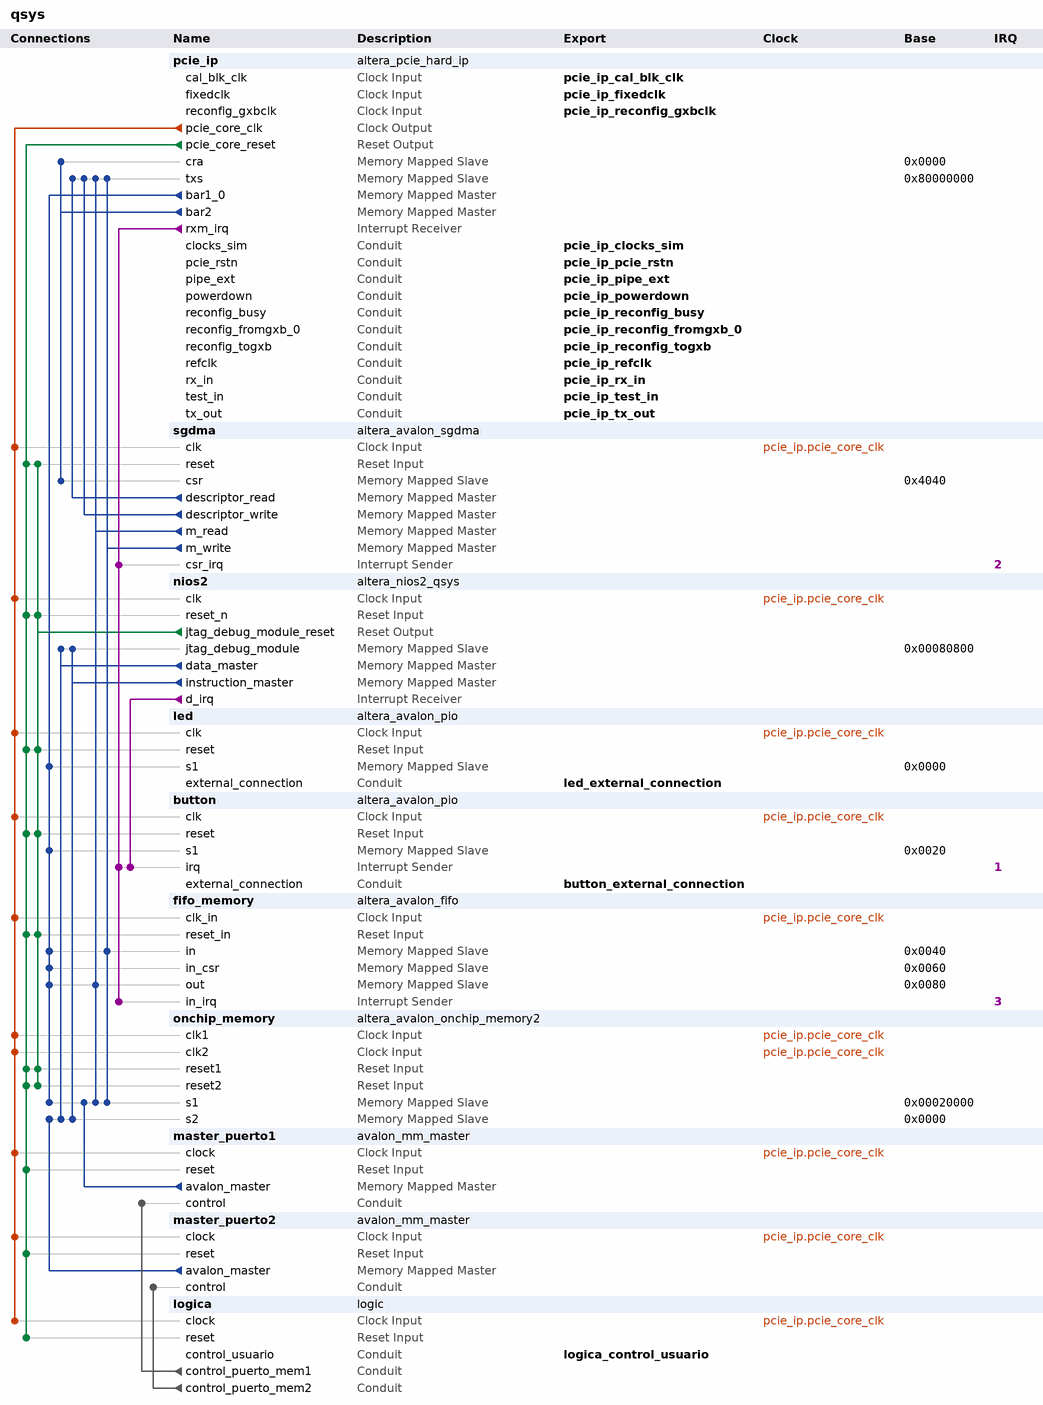
[diagram p0: system contents]
# Platform Designer (Qsys) system qsys, Cyclone IV GX EP4CGX150DF31C7
# Parameters at their usual value, and those the tool derives, are not listed.
package require -exact qsys 15.1
create_system qsys
set_project_property DEVICE_FAMILY {Cyclone IV GX}
set_project_property DEVICE EP4CGX150DF31C7

add_instance pcie_ip altera_pcie_hard_ip 15.1
set_instance_parameter_value pcie_ip {BAR Type} {64 bit Prefetchable,Not used,32 bit Non-Prefetchable,Not used,Not used,Not used}
set_instance_parameter_value pcie_ip CB_A2P_ADDR_MAP_PASS_THRU_BITS 31
set_instance_parameter_value pcie_ip CG_ENABLE_A2P_INTERRUPT 0
set_instance_parameter_value pcie_ip CG_NO_CPL_REORDERING 0
set_instance_parameter_value pcie_ip {PCIe Address 31:0} 0x00000000,0x00000000,0x00000000,0x00000000,0x00000000,0x00000000,0x00000000,0x00000000,0x00000000,0x00000000,0x00000000,0x00000000,0x00000000,0x00000000,0x00000000,0x00000000
set_instance_parameter_value pcie_ip {PCIe Address 63:32} 0x00000000,0x00000000,0x00000000,0x00000000,0x00000000,0x00000000,0x00000000,0x00000000,0x00000000,0x00000000,0x00000000,0x00000000,0x00000000,0x00000000,0x00000000,0x00000000
set_instance_parameter_value pcie_ip class_code 0
set_instance_parameter_value pcie_ip device_id 57345
set_instance_parameter_value pcie_ip my_advanced_errors false
set_instance_parameter_value pcie_ip my_enable_ecrc_check false
set_instance_parameter_value pcie_ip my_enable_ecrc_gen false
set_instance_parameter_value pcie_ip p_pcie_test_out_width None
set_instance_parameter_value pcie_ip p_user_msi_enable 0
set_instance_parameter_value pcie_ip subsystem_device_id 4
set_instance_parameter_value pcie_ip subsystem_vendor_id 4466
set_instance_parameter_value pcie_ip vendor_id 4466

add_instance sgdma altera_avalon_sgdma 15.1
set_instance_parameter_value sgdma enableBurstTransfers false
set_instance_parameter_value sgdma enableUnalignedTransfers false
set_instance_parameter_value sgdma readBlockDataWidth 64
set_instance_parameter_value sgdma sinkErrorWidth 0
set_instance_parameter_value sgdma sourceErrorWidth 0
set_instance_parameter_value sgdma transferMode MEMORY_TO_MEMORY
set_instance_parameter_value sgdma writeBurstcountWidth 4

add_instance nios2 altera_nios2_qsys 15.1
set_instance_parameter_value nios2 breakSlave nios2.jtag_debug_module
set_instance_parameter_value nios2 exceptionSlave onchip_memory.s2
set_instance_parameter_value nios2 icache_size 4096
set_instance_parameter_value nios2 impl Tiny
set_instance_parameter_value nios2 muldiv_multiplierType DSPBlock
set_instance_parameter_value nios2 resetSlave onchip_memory.s2
set_instance_parameter_value nios2 resetrequest_enabled true

add_instance led altera_avalon_pio 15.1
set_instance_parameter_value led direction Output
set_instance_parameter_value led width 4

add_instance button altera_avalon_pio 15.1
set_instance_parameter_value button captureEdge true
set_instance_parameter_value button direction Input
set_instance_parameter_value button edgeType FALLING
set_instance_parameter_value button generateIRQ true
set_instance_parameter_value button irqType EDGE
set_instance_parameter_value button width 4

add_instance fifo_memory altera_avalon_fifo 15.1
set_instance_parameter_value fifo_memory avalonMMAvalonMMDataWidth 64
set_instance_parameter_value fifo_memory bitsPerSymbol 16
set_instance_parameter_value fifo_memory channelWidth 8
set_instance_parameter_value fifo_memory errorWidth 8
set_instance_parameter_value fifo_memory fifoDepth 2048
set_instance_parameter_value fifo_memory fifoInputInterfaceOptions AVALONMM_WRITE
set_instance_parameter_value fifo_memory fifoOutputInterfaceOptions AVALONMM_READ
set_instance_parameter_value fifo_memory singleClockMode true
set_instance_parameter_value fifo_memory symbolsPerBeat 2
set_instance_parameter_value fifo_memory useIRQ true
set_instance_parameter_value fifo_memory usePacket true
set_instance_parameter_value fifo_memory useReadControl false

add_instance onchip_memory altera_avalon_onchip_memory2 15.1
set_instance_parameter_value onchip_memory dataWidth 64
set_instance_parameter_value onchip_memory dualPort true
set_instance_parameter_value onchip_memory initMemContent true
set_instance_parameter_value onchip_memory initializationFileName {C:/Users/Mauricio Paz/Downloads/CodigoVerilog/quartus/filtros/datos_memoria.mif}
set_instance_parameter_value onchip_memory memorySize 131072
set_instance_parameter_value onchip_memory useNonDefaultInitFile true

add_instance master_puerto1 avalon_mm_master 1.0
set_instance_parameter_value master_puerto1 ADDRESS_BITS 18
set_instance_parameter_value master_puerto1 DATA_BITS 64

add_instance master_puerto2 avalon_mm_master 1.0
set_instance_parameter_value master_puerto2 ADDRESS_BITS 17
set_instance_parameter_value master_puerto2 DATA_BITS 64

add_instance logica logic 1.0
set_instance_parameter_value logica BITS_DATOS 8
set_instance_parameter_value logica BITS_DIRECCION_P1 18
set_instance_parameter_value logica BITS_DIRECCION_P2 17
set_instance_parameter_value logica BITS_PALABRA 64

# connections
add_connection pcie_ip.pcie_core_clk button.clk clock
add_connection pcie_ip.pcie_core_clk fifo_memory.clk_in clock
add_connection pcie_ip.pcie_core_clk led.clk clock
add_connection pcie_ip.pcie_core_clk logica.clock clock
add_connection pcie_ip.pcie_core_clk master_puerto1.clock clock
add_connection pcie_ip.pcie_core_clk master_puerto2.clock clock
add_connection pcie_ip.pcie_core_clk nios2.clk clock
add_connection pcie_ip.pcie_core_clk onchip_memory.clk1 clock
add_connection pcie_ip.pcie_core_clk onchip_memory.clk2 clock
add_connection pcie_ip.pcie_core_clk sgdma.clk clock
add_connection nios2.jtag_debug_module_reset button.reset reset
add_connection nios2.jtag_debug_module_reset fifo_memory.reset_in reset
add_connection nios2.jtag_debug_module_reset led.reset reset
add_connection nios2.jtag_debug_module_reset nios2.reset_n reset
add_connection nios2.jtag_debug_module_reset onchip_memory.reset1 reset
add_connection nios2.jtag_debug_module_reset onchip_memory.reset2 reset
add_connection nios2.jtag_debug_module_reset sgdma.reset reset
add_connection pcie_ip.pcie_core_reset button.reset reset
add_connection pcie_ip.pcie_core_reset fifo_memory.reset_in reset
add_connection pcie_ip.pcie_core_reset led.reset reset
add_connection pcie_ip.pcie_core_reset logica.reset reset
add_connection pcie_ip.pcie_core_reset master_puerto1.reset reset
add_connection pcie_ip.pcie_core_reset master_puerto2.reset reset
add_connection pcie_ip.pcie_core_reset nios2.reset_n reset
add_connection pcie_ip.pcie_core_reset onchip_memory.reset1 reset
add_connection pcie_ip.pcie_core_reset onchip_memory.reset2 reset
add_connection pcie_ip.pcie_core_reset sgdma.reset reset
add_connection master_puerto1.avalon_master onchip_memory.s1 avalon
set_connection_parameter_value master_puerto1.avalon_master/onchip_memory.s1 baseAddress 0x00020000
add_connection master_puerto2.avalon_master onchip_memory.s2 avalon
set_connection_parameter_value master_puerto2.avalon_master/onchip_memory.s2 baseAddress 0x0000
add_connection nios2.data_master nios2.jtag_debug_module avalon
set_connection_parameter_value nios2.data_master/nios2.jtag_debug_module baseAddress 0x00080800
add_connection nios2.data_master onchip_memory.s2 avalon
set_connection_parameter_value nios2.data_master/onchip_memory.s2 baseAddress 0x0000
add_connection nios2.instruction_master nios2.jtag_debug_module avalon
set_connection_parameter_value nios2.instruction_master/nios2.jtag_debug_module baseAddress 0x00080800
add_connection nios2.instruction_master onchip_memory.s2 avalon
set_connection_parameter_value nios2.instruction_master/onchip_memory.s2 baseAddress 0x0000
add_connection pcie_ip.bar1_0 button.s1 avalon
set_connection_parameter_value pcie_ip.bar1_0/button.s1 baseAddress 0x0020
add_connection pcie_ip.bar1_0 fifo_memory.in avalon
set_connection_parameter_value pcie_ip.bar1_0/fifo_memory.in baseAddress 0x0040
add_connection pcie_ip.bar1_0 fifo_memory.in_csr avalon
set_connection_parameter_value pcie_ip.bar1_0/fifo_memory.in_csr baseAddress 0x0060
add_connection pcie_ip.bar1_0 fifo_memory.out avalon
set_connection_parameter_value pcie_ip.bar1_0/fifo_memory.out baseAddress 0x0080
add_connection pcie_ip.bar1_0 led.s1 avalon
set_connection_parameter_value pcie_ip.bar1_0/led.s1 baseAddress 0x0000
add_connection pcie_ip.bar1_0 onchip_memory.s1 avalon
set_connection_parameter_value pcie_ip.bar1_0/onchip_memory.s1 baseAddress 0x00020000
add_connection pcie_ip.bar2 pcie_ip.cra avalon
set_connection_parameter_value pcie_ip.bar2/pcie_ip.cra baseAddress 0x0000
add_connection pcie_ip.bar2 sgdma.csr avalon
set_connection_parameter_value pcie_ip.bar2/sgdma.csr baseAddress 0x4040
add_connection sgdma.descriptor_read pcie_ip.txs avalon
set_connection_parameter_value sgdma.descriptor_read/pcie_ip.txs baseAddress 0x80000000
add_connection sgdma.descriptor_write pcie_ip.txs avalon
set_connection_parameter_value sgdma.descriptor_write/pcie_ip.txs baseAddress 0x80000000
add_connection sgdma.m_read fifo_memory.out avalon
set_connection_parameter_value sgdma.m_read/fifo_memory.out baseAddress 0x0080
add_connection sgdma.m_read onchip_memory.s1 avalon
set_connection_parameter_value sgdma.m_read/onchip_memory.s1 baseAddress 0x00020000
add_connection sgdma.m_read pcie_ip.txs avalon
set_connection_parameter_value sgdma.m_read/pcie_ip.txs baseAddress 0x80000000
add_connection sgdma.m_write fifo_memory.in avalon
set_connection_parameter_value sgdma.m_write/fifo_memory.in baseAddress 0x0040
add_connection sgdma.m_write onchip_memory.s1 avalon
set_connection_parameter_value sgdma.m_write/onchip_memory.s1 baseAddress 0x00020000
add_connection sgdma.m_write pcie_ip.txs avalon
set_connection_parameter_value sgdma.m_write/pcie_ip.txs baseAddress 0x80000000
add_connection logica.control_puerto_mem1 master_puerto1.control conduit
add_connection logica.control_puerto_mem2 master_puerto2.control conduit
add_connection nios2.d_irq button.irq interrupt
set_connection_parameter_value nios2.d_irq/button.irq irqNumber 0
add_connection pcie_ip.rxm_irq button.irq interrupt
set_connection_parameter_value pcie_ip.rxm_irq/button.irq irqNumber 1
add_connection pcie_ip.rxm_irq fifo_memory.in_irq interrupt
set_connection_parameter_value pcie_ip.rxm_irq/fifo_memory.in_irq irqNumber 3
add_connection pcie_ip.rxm_irq sgdma.csr_irq interrupt
set_connection_parameter_value pcie_ip.rxm_irq/sgdma.csr_irq irqNumber 2

# exported interfaces
add_interface button_external_connection conduit end
set_interface_property button_external_connection EXPORT_OF button.external_connection
add_interface led_external_connection conduit end
set_interface_property led_external_connection EXPORT_OF led.external_connection
add_interface logica_control_usuario conduit end
set_interface_property logica_control_usuario EXPORT_OF logica.control_usuario
add_interface pcie_ip_cal_blk_clk clock sink
set_interface_property pcie_ip_cal_blk_clk EXPORT_OF pcie_ip.cal_blk_clk
add_interface pcie_ip_clocks_sim conduit end
set_interface_property pcie_ip_clocks_sim EXPORT_OF pcie_ip.clocks_sim
add_interface pcie_ip_fixedclk clock sink
set_interface_property pcie_ip_fixedclk EXPORT_OF pcie_ip.fixedclk
add_interface pcie_ip_pcie_rstn conduit end
set_interface_property pcie_ip_pcie_rstn EXPORT_OF pcie_ip.pcie_rstn
add_interface pcie_ip_pipe_ext conduit end
set_interface_property pcie_ip_pipe_ext EXPORT_OF pcie_ip.pipe_ext
add_interface pcie_ip_powerdown conduit end
set_interface_property pcie_ip_powerdown EXPORT_OF pcie_ip.powerdown
add_interface pcie_ip_reconfig_busy conduit end
set_interface_property pcie_ip_reconfig_busy EXPORT_OF pcie_ip.reconfig_busy
add_interface pcie_ip_reconfig_fromgxb_0 conduit end
set_interface_property pcie_ip_reconfig_fromgxb_0 EXPORT_OF pcie_ip.reconfig_fromgxb_0
add_interface pcie_ip_reconfig_gxbclk clock sink
set_interface_property pcie_ip_reconfig_gxbclk EXPORT_OF pcie_ip.reconfig_gxbclk
add_interface pcie_ip_reconfig_togxb conduit end
set_interface_property pcie_ip_reconfig_togxb EXPORT_OF pcie_ip.reconfig_togxb
add_interface pcie_ip_refclk conduit end
set_interface_property pcie_ip_refclk EXPORT_OF pcie_ip.refclk
add_interface pcie_ip_rx_in conduit end
set_interface_property pcie_ip_rx_in EXPORT_OF pcie_ip.rx_in
add_interface pcie_ip_test_in conduit end
set_interface_property pcie_ip_test_in EXPORT_OF pcie_ip.test_in
add_interface pcie_ip_tx_out conduit end
set_interface_property pcie_ip_tx_out EXPORT_OF pcie_ip.tx_out

set_interconnect_requirement {$system} qsys_mm.clockCrossingAdapter HANDSHAKE
set_interconnect_requirement {$system} qsys_mm.maxAdditionalLatency 1

save_system qsys.qsys
